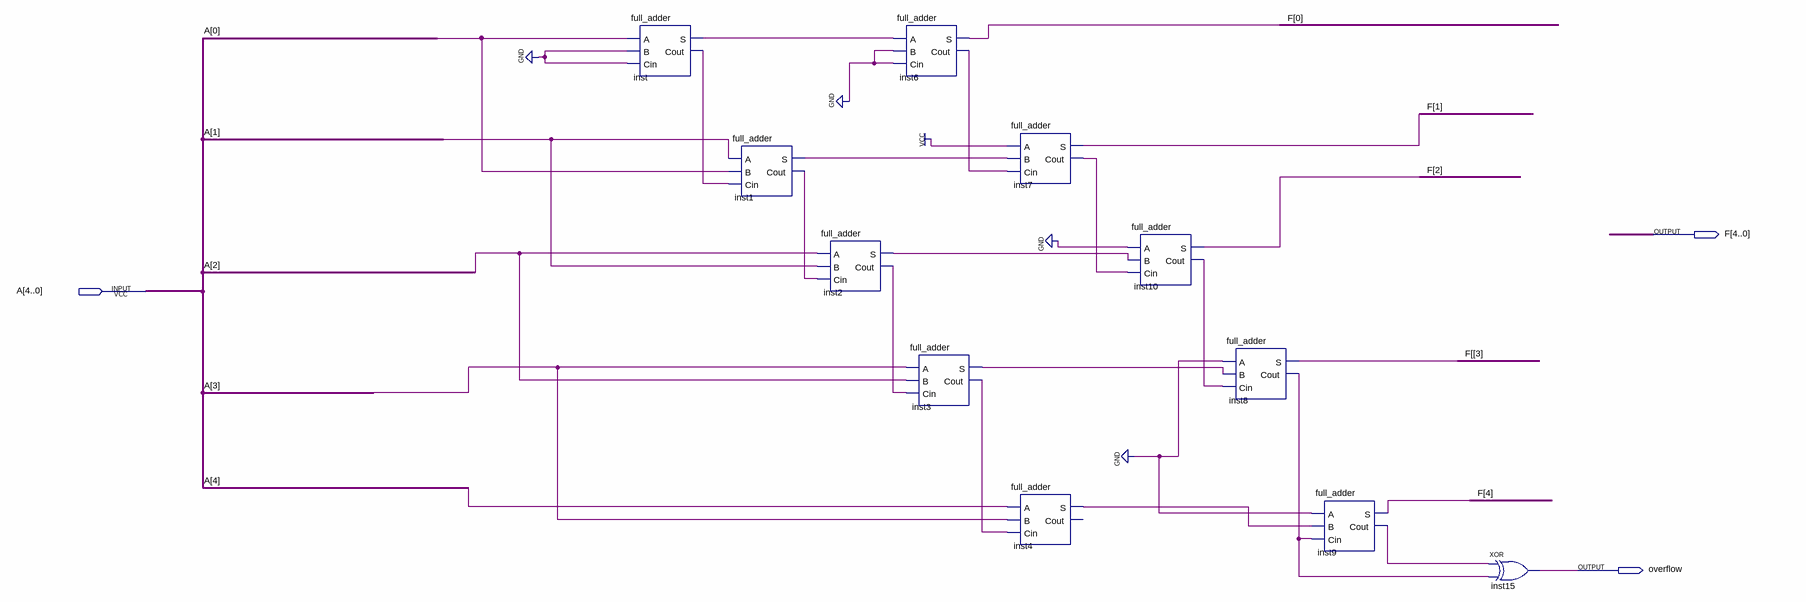
[diagram p0: schematic sheet]
// Quartus schematic ax3+2.bdf as structural Verilog: 11 symbols, 3 pins
module \ax3+2  (
  input  [4:0] A,
  output [4:0] F,
  output overflow
);

  wire inst1_cout, inst1_s, inst2_cout, inst2_s, inst3_cout, inst3_s, inst4_s, inst6_cout, inst7_cout,
       inst8_cout, inst9_cout, inst10_cout, inst_cout, inst_s;
  wire [3:3] \F[ ;

  full_adder inst (.A(A[0]), .B(1'b0), .Cin(1'b0), .S(inst_s), .Cout(inst_cout));
  full_adder inst1 (.A(A[1]), .B(A[0]), .Cin(inst_cout), .S(inst1_s), .Cout(inst1_cout));
  full_adder inst2 (.A(A[2]), .B(A[1]), .Cin(inst1_cout), .S(inst2_s), .Cout(inst2_cout));
  full_adder inst6 (.A(inst_s), .B(1'b0), .Cin(1'b0), .S(F[0]), .Cout(inst6_cout));
  full_adder inst3 (.A(A[3]), .B(A[2]), .Cin(inst2_cout), .S(inst3_s), .Cout(inst3_cout));
  full_adder inst7 (.A(1'b1), .B(inst1_s), .Cin(inst6_cout), .S(F[1]), .Cout(inst7_cout));
  full_adder inst4 (.A(A[4]), .B(A[3]), .Cin(inst3_cout), .S(inst4_s));  // open: Cout
  full_adder inst10 (.A(1'b0), .B(inst2_s), .Cin(inst7_cout), .S(F[2]), .Cout(inst10_cout));
  full_adder inst8 (.A(1'b0), .B(inst3_s), .Cin(inst10_cout), .S(\F[ [3]), .Cout(inst8_cout));
  full_adder inst9 (.A(1'b0), .B(inst4_s), .Cin(inst8_cout), .S(F[4]), .Cout(inst9_cout));
  xor inst15 (overflow, inst9_cout, inst8_cout);
endmodule
